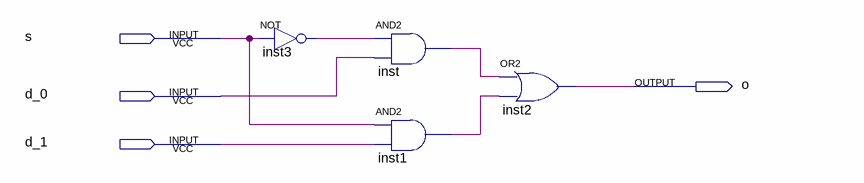
[diagram p0: schematic sheet]
// Quartus schematic MUX_2X1.bdf as structural Verilog: 4 symbols, 4 pins
module MUX_2X1 (
  input  s,
  input  d_0,
  input  d_1,
  output o
);

  wire inst1_out, inst3_out, inst_out;

  not inst3 (inst3_out, s);
  and inst (inst_out, inst3_out, d_0);
  and inst1 (inst1_out, s, d_1);
  or inst2 (o, inst_out, inst1_out);
endmodule
